# EAGLE schematic Aegis PCB 3D - 3 v10 (EAGLE 9.7.0)

## Sheet 1 of 4
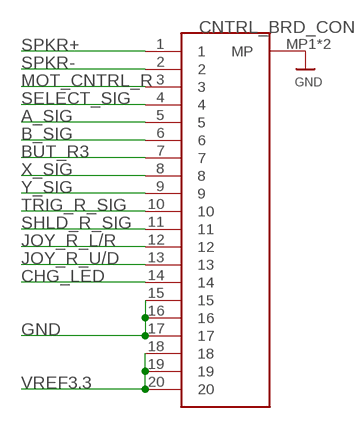
[diagram p0: schematic, sheet 1]

### Parts
CNTRL_BRD_CONN  CONN-0527462033  [CONN-0527462033]

### Nets
A_SIG: CNTRL_BRD_CONN.5 ; also sheet 2
B_SIG: CNTRL_BRD_CONN.6 ; also sheet 2
BUT_R3: CNTRL_BRD_CONN.7 ; also sheet 2
CHG_LED: CNTRL_BRD_CONN.14 ; also sheet 4
GND: CNTRL_BRD_CONN.15 CNTRL_BRD_CONN.16 CNTRL_BRD_CONN.17 CNTRL_BRD_CONN.MP1(MP) CNTRL_BRD_CONN.MP2(MP) ; also sheet 2,3,4
JOY_R_L/R: CNTRL_BRD_CONN.12 ; also sheet 2
JOY_R_U/D: CNTRL_BRD_CONN.13 ; also sheet 2
MOT_CNTRL_R: CNTRL_BRD_CONN.3 ; also sheet 2
SELECT_SIG: CNTRL_BRD_CONN.4 ; also sheet 2
SHLD_R_SIG: CNTRL_BRD_CONN.11 ; also sheet 2
SPKR+: CNTRL_BRD_CONN.1 ; also sheet 3
SPKR-: CNTRL_BRD_CONN.2 ; also sheet 3
TRIG_R_SIG: CNTRL_BRD_CONN.10 ; also sheet 2
VREF3.3: CNTRL_BRD_CONN.18 CNTRL_BRD_CONN.19 CNTRL_BRD_CONN.20 ; also sheet 2,4
X_SIG: CNTRL_BRD_CONN.8 ; also sheet 2
Y_SIG: CNTRL_BRD_CONN.9 ; also sheet 2

## Sheet 2 of 4
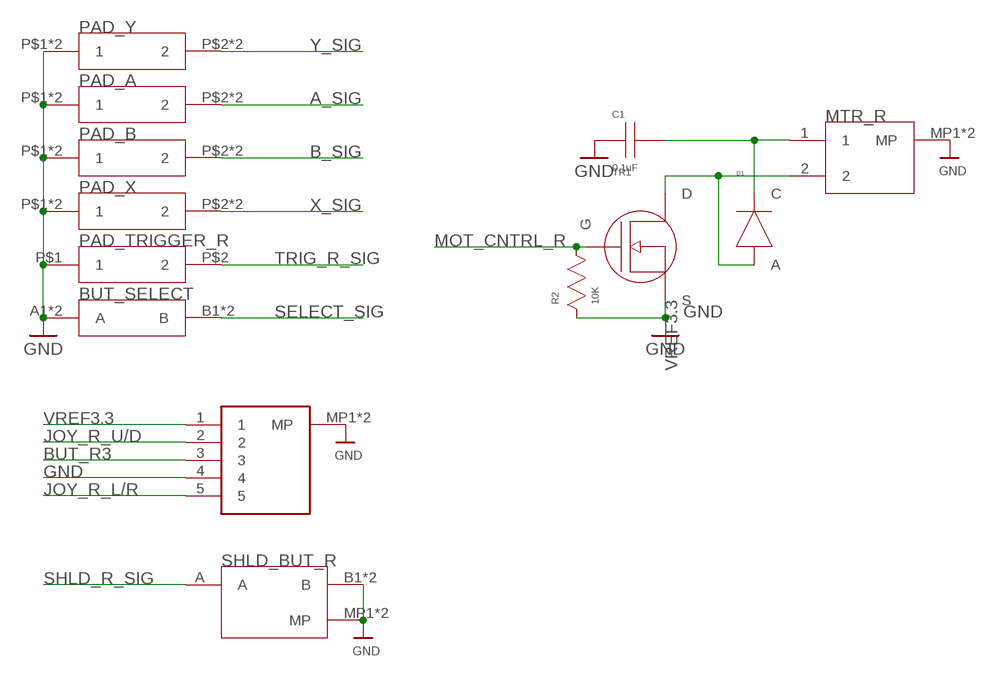
[diagram p1: schematic, sheet 2]

### Parts
BUT_SELECT  BUT-R-667834  [BUT-R-667834]
C1  0.1uF  CAP-603  [CAP-603]
D1  DIODE-X3-WLB1608-2  [DIODE-X3-WLB1608-2]
JOYSTICK_R  CONN-046809605110846+  [CONN-046809605110846+]
MTR_R  CONN-0781710002  [CONN-0781710002]
PAD_A  AEGIS-BUTTONPAD  [AEGIS-BUTTONPAD]
PAD_B  AEGIS-BUTTONPAD  [AEGIS-BUTTONPAD]
PAD_TRIGGER_R  AEGIN-SHLDPAD  [AEGIN-SHLDPAD]
PAD_X  AEGIS-BUTTONPAD  [AEGIS-BUTTONPAD]
PAD_Y  AEGIS-BUTTONPAD  [AEGIS-BUTTONPAD]
R2  10K  RES-603  [RES-603]
SHLD_BUT_R  AEGIN-SHLDBUT  [AEGIN-SHLDBUT]
TR1  TRAN-DMG2302UKQ  [TRAN-DMG2302UKQ]

### Nets
A_SIG: PAD_A.P$2 PAD_A.P$4 ; also sheet 1
B_SIG: PAD_B.P$2 PAD_B.P$4 ; also sheet 1
BUT_R3: JOYSTICK_R.3 ; also sheet 1
GND: BUT_SELECT.A1(A) BUT_SELECT.A2(A) C1.A JOYSTICK_R.4 JOYSTICK_R.MP1(MP) JOYSTICK_R.MP2(MP) MTR_R.MP1(MP) MTR_R.MP2(MP) PAD_A.P$1 PAD_A.P$3 PAD_B.P$1 PAD_B.P$3 PAD_TRIGGER_R.P$1 PAD_X.P$1 PAD_X.P$3 PAD_Y.P$1 PAD_Y.P$3 R2.A SHLD_BUT_R.B1(B) SHLD_BUT_R.B2(B) SHLD_BUT_R.MP1(MP) SHLD_BUT_R.MP2(MP) TR1.S ; also sheet 1,3,4
JOY_R_L/R: JOYSTICK_R.5 ; also sheet 1
JOY_R_U/D: JOYSTICK_R.2 ; also sheet 1
MOT_CNTRL_R: R2.C TR1.G ; also sheet 1
N$8: D1.A MTR_R.2 TR1.D
SELECT_SIG: BUT_SELECT.B1(B) BUT_SELECT.B2(B) ; also sheet 1
SHLD_R_SIG: SHLD_BUT_R.A ; also sheet 1
TRIG_R_SIG: PAD_TRIGGER_R.P$2 ; also sheet 1
VREF3.3: C1.C D1.C JOYSTICK_R.1 MTR_R.1 ; also sheet 1,4
X_SIG: PAD_X.P$2 PAD_X.P$4 ; also sheet 1
Y_SIG: PAD_Y.P$2 PAD_Y.P$4 ; also sheet 1

## Sheet 3 of 4: Audio
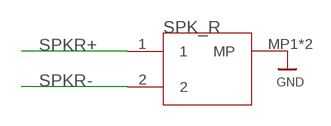
[diagram p2: schematic, sheet 3]

### Parts
SPK_R  CONN-0781710002  [CONN-0781710002]

### Nets
GND: SPK_R.MP1(MP) SPK_R.MP2(MP) ; also sheet 1,2,4
SPKR+: SPK_R.1 ; also sheet 1
SPKR-: SPK_R.2 ; also sheet 1

## Sheet 4 of 4: LED
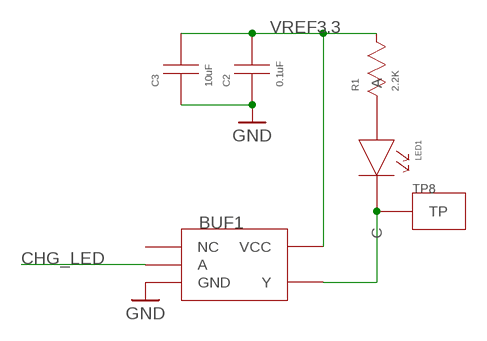
[diagram p3: schematic, sheet 4]

### Parts
BUF1  BUF-74LVC1G07  [BUF-74LVC1G07]
C2  0.1uF  CAP-603  [CAP-603]
C3  10uF  CAP-603  [CAP-603]
LED1  LED-SM0805UWC  [LED-SM0805UWC]
R1  2.2K  RES-603  [RES-603]
TP8  TESTPOINT  [TESTPOINT]

### Nets
CHG_LED: BUF1.A ; also sheet 1
GND: BUF1.GND C2.A C3.A ; also sheet 1,2,3
N$50: LED1.A R1.A
N$51: BUF1.Y LED1.C TP8.TP
VREF3.3: BUF1.VCC C2.C C3.C R1.C ; also sheet 1,2
Unconnected: BUF1.NC

## Library data of the parts
BUF1 = Personal:BUF-74LVC1G07
BUT_SELECT = Personal:BUT-R-667834
C1-C3 = Personal:CAP-603
CNTRL_BRD_CONN = Personal:CONN-0527462033
D1 = Personal:DIODE-X3-WLB1608-2
JOYSTICK_R = Personal:CONN-046809605110846+
LED1 = Personal:LED-SM0805UWC
MTR_R SPK_R = Personal:CONN-0781710002
PAD_A PAD_B PAD_X PAD_Y = Personal:AEGIS-BUTTONPAD
PAD_TRIGGER_R = Personal:AEGIN-SHLDPAD
R1 R2 = Personal:RES-603
SHLD_BUT_R = Personal:AEGIN-SHLDBUT
TP8 = Personal:TESTPOINT
TR1 = Personal:TRAN-DMG2302UKQ